# Altium schematic sheet HDMI Connector for RK3399.SchDoc: RK3399 COB Design V1.0
size A4; Author: AVIRAL MISHRA; DocumentNumber: 19; SheetNumber: 19; SheetTotal: 27; PROJECT CODE: A_V1.0
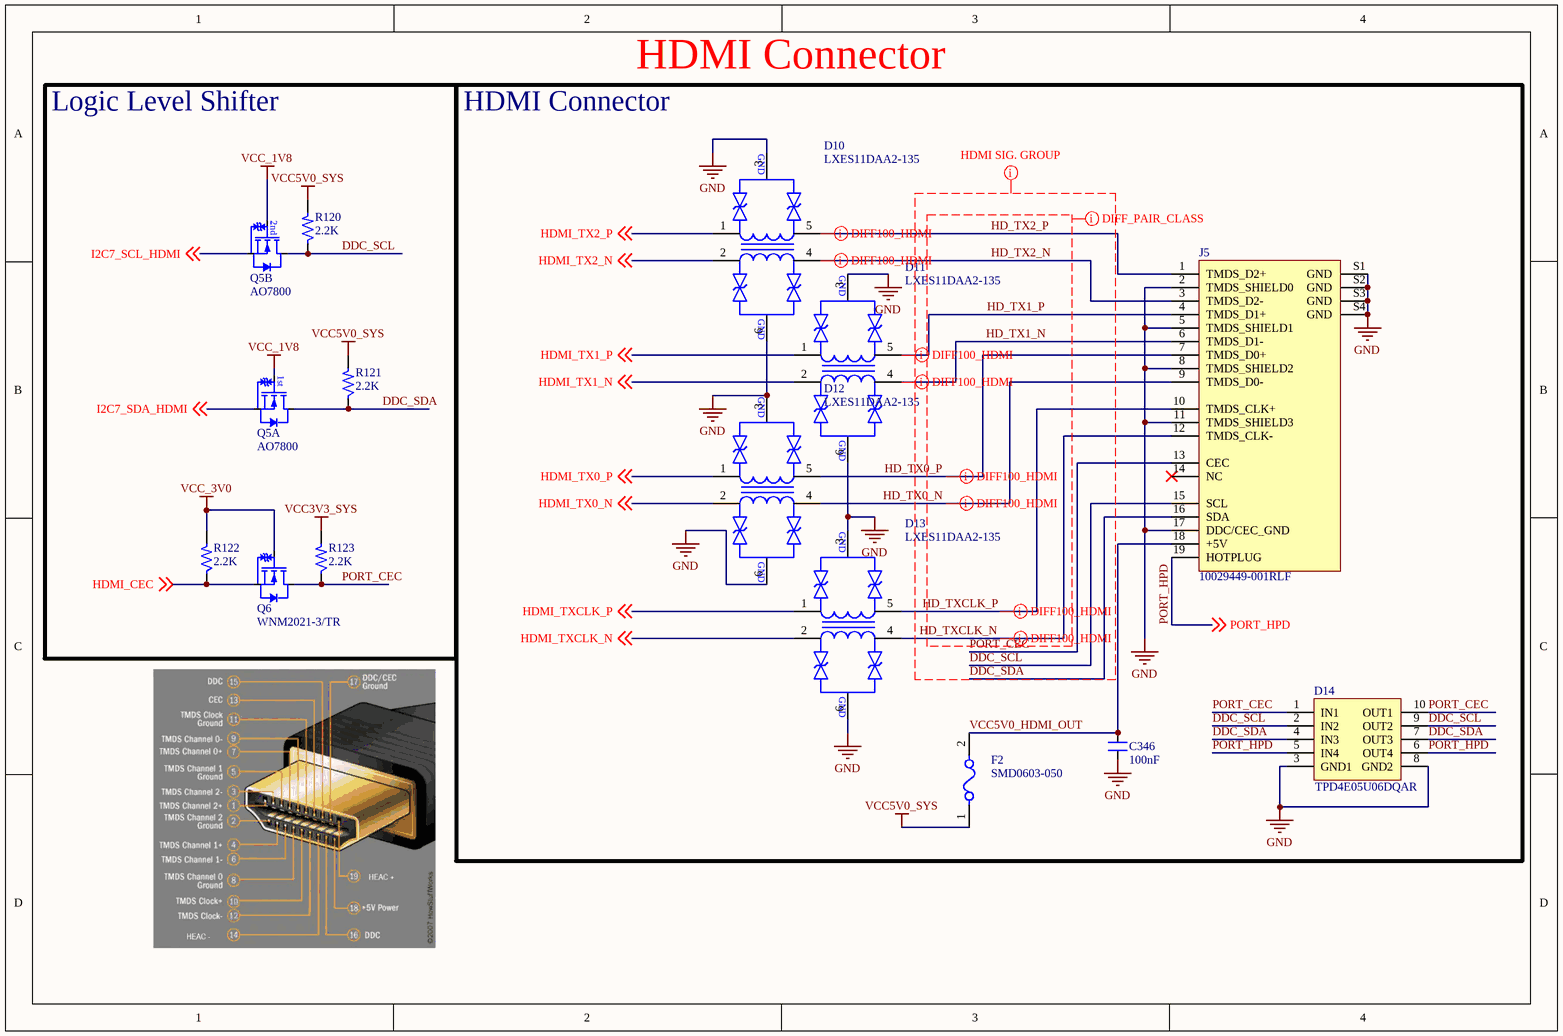
[diagram p0: HDMI Connector for RK3399.SchDoc]

## Parts
C346  100nF  [CAP_0603]
D10  LXES11DAA2-135  [DIO_LXES11D_SMD]
D11  LXES11DAA2-135  [DIO_LXES11D_SMD]
D12  LXES11DAA2-135  [DIO_LXES11D_SMD]
D13  LXES11DAA2-135  [DIO_LXES11D_SMD]
D14  TPD4E05U06DQAR  [DIO_USON-10_SMD]
F2  SMD0603-050  [RES_0603]
J5  10029449-001RLF  [CON19_19.6_10029449-001RLF_TH_RA]
Q5  AO7800  [SOT363-6]  (parts A,B of 2)
Q6  WNM2021-3/TR  [SOT-323-3]
R120  2.2K  [RES_0603]
R121  2.2K  [RES_0603]
R122  2.2K  [RES_0603]
R123  2.2K  [RES_0603]

## Blocks framed on the sheet
Logic Level Shifter: Q5 Q6 R120-R123
HDMI Connector: C346 D10-D14 F2 J5

## Nets
GND: C346.1 D10.3 D10.6 D11.3 D11.6 D12.3 D12.6 D13.3 D13.6 D14.3(GND1) D14.8(GND2) J5.2(TMDS_SHIELD0) J5.5(TMDS_SHIELD1) J5.8(TMDS_SHIELD2) J5.11(TMDS_SHIELD3) J5.17(DDC/CEC_GND) J5.S1(GND) J5.S2(GND) J5.S3(GND) J5.S4(GND)
VCC3V3_SYS: R123.2
VCC5V0_SYS: F2.1 R120.2 R121.2
VCC_1V8: Q5.2(G1) Q5.5(G2)
VCC_3V0: Q6.1(G) R122.2
DDC_SCL: D14.2(IN2) D14.9(OUT2) J5.15(SCL) Q5.3(D2) R120.1
DDC_SDA: D14.4(IN3) D14.7(OUT3) J5.16(SDA) Q5.6(D1) R121.1
HD_TX0_N: D12.4 J5.9(TMDS_D0-)
HD_TX0_P: D12.5 J5.7(TMDS_D0+)
HD_TX1_N: D11.4 J5.6(TMDS_D1-)
HD_TX1_P: D11.5 J5.4(TMDS_D1+)
HD_TX2_N: D10.4 J5.3(TMDS_D2-)
HD_TX2_P: D10.5 J5.1(TMDS_D2+)
HD_TXCLK_N: D13.4 J5.12(TMDS_CLK-)
HD_TXCLK_P: D13.5 J5.10(TMDS_CLK+)
HDMI_CEC: Q6.2(S) R122.1 ; off-sheet HDMI_CEC
HDMI_TX0_N: D12.2 ; off-sheet HDMI_TX0_N
HDMI_TX0_P: D12.1 ; off-sheet HDMI_TX0_P
HDMI_TX1_N: D11.2 ; off-sheet HDMI_TX1_N
HDMI_TX1_P: D11.1 ; off-sheet HDMI_TX1_P
HDMI_TX2_N: D10.2 ; off-sheet HDMI_TX2_N
HDMI_TX2_P: D10.1 ; off-sheet HDMI_TX2_P
HDMI_TXCLK_N: D13.2 ; off-sheet HDMI_TXCLK_N
HDMI_TXCLK_P: D13.1 ; off-sheet HDMI_TXCLK_P
I2C7_SCL_HDMI: Q5.4(S2) ; off-sheet I2C7_SCL_HDMI
I2C7_SDA_HDMI: Q5.1(S1) ; off-sheet I2C7_SDA_HDMI
PORT_CEC: D14.1(IN1) D14.10(OUT1) J5.13(CEC) Q6.3(D) R123.1
PORT_HPD: D14.5(IN4) D14.6(OUT4) J5.19(HOTPLUG) ; off-sheet PORT_HPD
VCC5V0_HDMI_OUT: C346.2 F2.2 J5.18(+5V)

Not connected (* = marked no-connect by the designer): J5 14(NC)*

## Layout directives
differential pair; differential pair class DIFF100_HDMI: HD_TX0_N, HD_TX0_P, HD_TX1_N, HD_TX1_P, HD_TX2_N, HD_TX2_P, HD_TXCLK_N, HD_TXCLK_P
net class HDMI SIG. GROUP: DDC_SCL, DDC_SDA, HD_TX1_N, HD_TX1_P, HD_TX2_N, HD_TX2_P, HD_TXCLK_N, HD_TXCLK_P, PORT_CEC
net class DIFF_PAIR_CLASS: HD_TX1_N, HD_TX1_P, HD_TX2_N, HD_TX2_P

## Notes on the sheet
- HDMI Connector
- TITLE:
- DOCUMENT NAME:
- SCALE 1:1
- This document is copyright of EsteemPCB and shall not be revealed, produced, copied, in whole or in part, nor
- PROJECT CODE:
- TEMPLATE:
- A4
- AUTHOR:
- Sheet
- of
- used for any purpose other than submitted.
- (in symbol DIO-T-A_5V-6SMD) GND
- (in symbol MOSFET-N_20V-0.9A-SOT-363, part A) 1st
- (in symbol MOSFET-N_20V-0.9A-SOT-363, part B) 2nd

## Library data of the parts
C346 = CAP_100nF-10V-5%-0603: 0.1µF ±10% 10V Ceramic Capacitor X7R 0603 (1608 Metric) /; Manufacturer: Yageo; Manufacturer Part Number: CC0603KRX7R6BB104; Case/Package: 0603; Supplier-1: Digikey
D10-D13 = DIO-T-A_5V-6SMD: Clamp Ipp Tvs Diode Surface Mount 10-SMD; Manufacturer: Murata Electronics; Manufacturer Part Number: LXES11DAA2-135; Case/Package: SMD-6; Supplier-1: Digikey
D14 = DIO-T_5.5V-14V-2.5A-10-USON: 14V Clamp 2.5A (8/20µs) Ipp Tvs Diode Surface Mount 10-USON (2.5x1) /; Manufacturer: Texas Instruments; Manufacturer Part Number: TPD4E05U06DQAR; Case/Package: 10-USON; Supplier-1: Digikey
F2 = FUSE_1A-6V-0603: 6V 1A 0603 PTC Resettable Fuses RoHS; Manufacturer: TECHFUSE; Manufacturer Part Number: SMD0603-050; Case/Package: 0603; Supplier-1: LCSC
J5 = CON-HDMI_10029449-001RLF-RA-TH: HDMI HDMI 1.4 Receptacle Connector 19 Position Surface Mount, Right Angle; Through Hole; Manufacturer: Amphenol ICC (FCI); Manufacturer Part Number: 10029449-001RLF; Case/Package: TH; Supplier-1: Digikey
Q5 = MOSFET-N_20V-0.9A-SOT-363: DualNChannel 20V 900mA 900mV @ 250uA 300mΩ @ 900mA,4.5V 300mW SC-70-6(SOT-363) MOSFET RoHS /; Manufacturer: Alpha & Omega Semicon; Mnaufacturer Part Number: AO7800; Case/Package: SC-70-6(SOT-363); Supplier-1: LCSC
Q6 = MOSFET-N_20V-820mA-SOT-323: N Channel 20V 820mA 850mV @ 250uA 310mΩ @ 550mA,4.5V 310mW SOT-323(SC-70) MOSFET RoHS /; Manufacturer: WILLSEMI(Will Semicon); Manufacturer Part Number: WNM2021-3/TR; Case/Package: SOT-323(SC-70); Supplier-1: LCSC
R120-R123 = RES_2.2K-0.1W-1%-0603: 2.2 kOhms ±1% 0.1W, 1/10W Chip Resistor 0603 (1608 Metric) Thick Film /; Manufacturer: Yageo; Manufacturer Part Number: RC0603FR-072K2L; Case/Package: 0603; Supplier-1: Digikey